# EAGLE design esp-01-test (EAGLE 6.4)
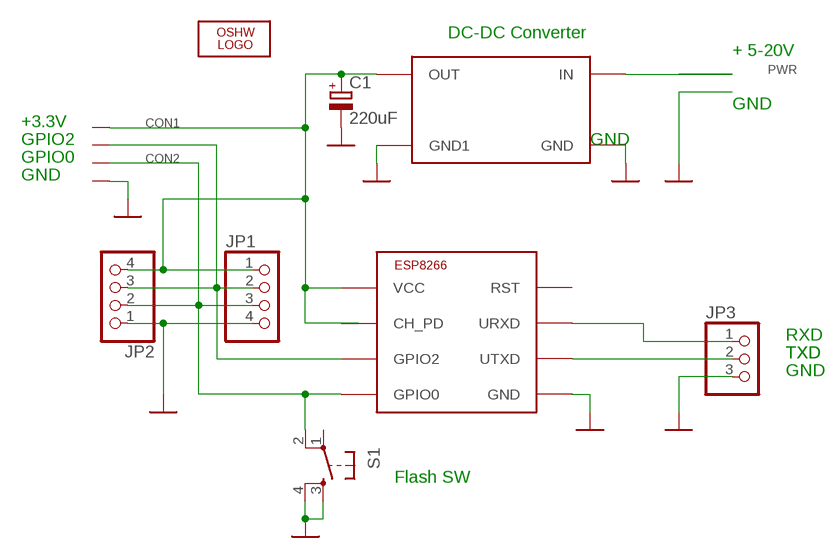
[diagram p0: schematic, sheet 1]

## Parts
C1  220uF  CPOL-EUE3.5-8  [E3,5-8]
CON1  ARK550/2  [ARK550/2]
CON2  ARK550/2  [ARK550/2]
JP1  PINHD-1X4  [1X04]
JP2  PINHD-1X4  [1X04]
JP3  PINHD-1X3  [1X03]
LOGO1  OSHW_LOGO_8MILX0200-NT  [OSHW_8X200_NOTEXT]
PWR  ARK550/2  [ARK550/2]
S1  TAC_SWITCHPTH  [TACTILE-PTH]
U$1  ESP8266-01  [ESP-01]
U$2  DC-DC-SMALL  [DC-DC]

## Nets
GND: C1.- CON2.2 JP1.4 JP2.1 JP3.3 PWR.2 S1.3 S1.4 U$1.P$8(GND) U$2.P$3(GND) U$2.P$4(GND1)
N$1: JP3.1 U$1.P$5(URXD)
N$2: JP3.2 U$1.P$1(UTXD)
N$3: C1.+ CON1.1 JP1.1 JP2.4 U$1.P$2(CH_PD) U$1.P$4(VCC) U$2.P$2(OUT)
N$4: CON1.2 JP1.2 JP2.3 U$1.P$7(GPIO2)
N$5: CON2.1 JP1.3 JP2.2 S1.2 U$1.P$6(GPIO0)
N$6: PWR.1 U$2.P$1(IN)
Unconnected: S1.1 U$1.P$3(RST)

## Notes on the sheet
- DC-DC Converter
- + 5-20V
- GND
- +3.3V
- GPIO2 | GND
- GPIO0
- GND
- RXD
- TXD | TXD
- GND
- Flash SW

## Library data of the parts
C1 = rcl:CPOL-EU: POLARIZED CAPACITOR, European symbol
CON1 CON2 PWR = #_GM99:ARK550/2
JP1 JP2 = pinhead:PINHD-1X4: PIN HEADER
JP3 = pinhead:PINHD-1X3: PIN HEADER
LOGO1 = ohw-logo:OSHW_LOGO_8MIL
S1 = #sparkfun:TAC_SWITCH: Momentary Switch Button commonly used for reset or general input. Spark Fun Electronics SKU : COM-00097
U$1 = #ESP8266:ESP8266-01: ESP8266 - ESP-01 Module
U$2 = #OK1CDJ-E6:DC-DC-SMALL

## Board
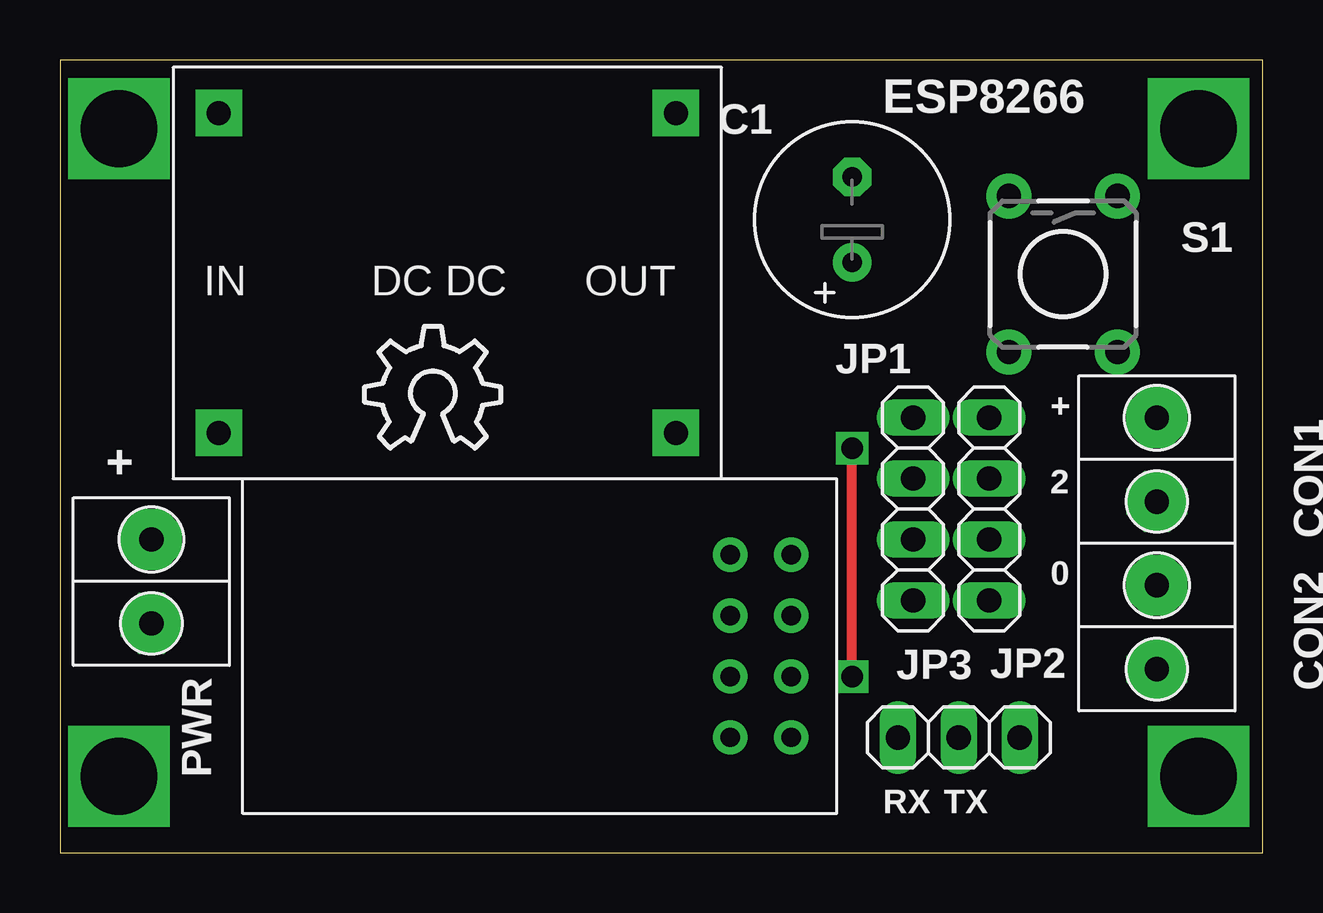
[diagram p1: board, top side]
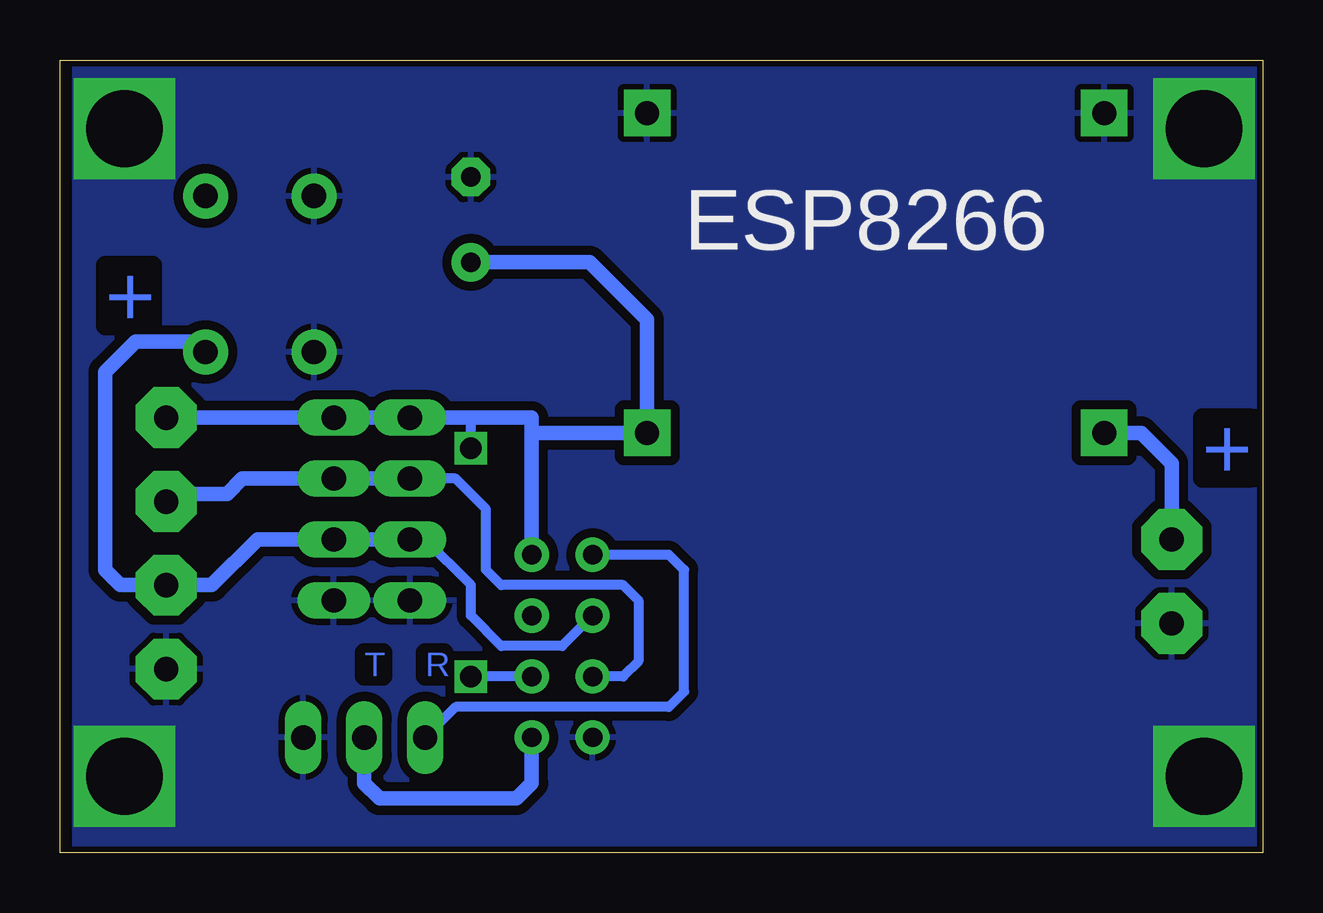
[diagram p2: board, bottom side, seen from below]

Size 50.15 x 33.05 mm. Coordinates in mm from the lower left corner, seen from the top.
Outline: 0,0 50.15,0 50.15,33.05 0,33.05 0,0
Copper layers (1*16): Top 0.035mm / dielectric 1.5mm / Bottom 0.035mm
Design rules "default *": minimum track width 10mil, minimum drill 24mil, track to track 15mil, track to pad 15mil, pad to pad 15mil, via to via 8mil, smd to smd 8mil, copper to edge 10mil, drill to drill 8mil, minimum pad ring 10mil, minimum via ring 8mil, stop-mask expansion 4mil, vias tented up to drill 0mil, thermal gap 10mil

### Footprints (pad centres in the part's own frame; a part is rotated, then mirrored left to right if it is on the bottom)
E3,5-8 = drill 0.813 pad 1.6: + -1.778,0 | drill 0.813 pad 1.6 octagon: - 1.778,0
ARK550/2 = drill 1.016 pad 2.54 octagon: 1 0,0; 2 3.5,0
1X04 = drill 1.016 long: 1 -3.81,0; 2 -1.27,0; 3 1.27,0; 4 3.81,0
1X03 = drill 1.016 long: 1 -2.54,0; 2 0,0; 3 2.54,0
TACTILE-PTH = drill 1.016 pad 1.88: 1 -3.251,2.261; 2 3.251,2.261; 3 -3.251,-2.261; 4 3.251,-2.261
ESP-01 = drill 0.8 pad 1.422: P$1 0,0; P$2 2.54,0; P$3 5.08,0; P$4 7.62,0; P$5 7.62,2.54; P$6 5.08,2.54; P$7 2.54,2.54; P$8 0,2.54
DC-DC = drill 1 pad 1.93 square: P$1 1.27,1.27; P$2 20.32,1.27; P$3 1.27,14.605; P$4 20.32,14.605

### Placement (x,y rotation side)
C1  33.02,26.4 90 top
CON1  45.72,18.14 270 top
CON2  45.72,11.16 270 top
JP1  35.56,14.33 270 top
JP2  38.73,14.33 90 top
JP3  37.47,4.81 0 top
LOGO1  12.7,16.88 0 top
PWR  3.81,13.06 270 top
S1  41.82,24.13 270 top
U$1  30.48,4.81 90 top
U$2  5.35,16.24 0 top

### Tracks (layer width: path | path; a pad name or v marks a point on that pad's centre or on a via)
GND  (via drill 3.2)
  other vias: 2.46,30.19 2.46,3.19 47.46,3.19 47.46,30.19
  pour Bottom: -1.27,32.75 49.53,32.75 49.53,-0.9 -1.27,-0.9
N$1
  Bottom 0.406: JP3.1 33.66,6.08 24.77,6.08 24.13,6.71 24.13,11.79 24.77,12.43 U$1.P$5
N$2
  Bottom 0.61: JP3.2 37.47,2.9 36.83,2.27 31.11,2.27 30.48,2.9 U$1.P$1
N$3  (via drill 0.9)
  Top 0.406: v33.02,7.35 v33.02,16.88
  Bottom 0.406: U$1.P$2 v33.02,7.35 | v33.02,16.88 33.02,18.14
  Bottom 0.61: C1.+ 28.07,24.62 25.67,22.23 U$2.P$2 30.48,17.51 | U$1.P$4 30.48,17.51 | CON1.1 JP2.4 JP1.1 33.02,18.14 30.48,18.14 30.48,17.51
N$4
  Bottom 0.406: U$1.P$7 26.67,7.35 26.04,7.99 26.04,10.53 26.67,11.16 31.75,11.16 32.39,11.79 32.39,14.33 33.66,15.6 JP1.2
  Bottom 0.61: JP1.2 JP2.3 42.55,15.6 43.18,14.97 45.4,14.97 CON1.2
N$5
  Bottom 0.406: U$1.P$6 29.21,8.62 31.75,8.62 33.02,9.89 33.02,11.16 34.93,13.06 JP1.3
  Bottom 0.61: JP1.3 JP2.2 41.91,13.06 43.82,11.16 CON2.1 47.62,11.16 48.26,11.79 48.26,20.05 46.99,21.32 44.52,21.32 S1.2
N$6
  Bottom 0.61: PWR.1 3.81,16.24 5.08,17.51 U$2.P$1

### Text on the board
Bottom: + | + | R | T
tNames: ESP8266 | + | + | 2 | 0 | RX | TX
bNames: ESP8266